# Altium project CS1237-24-Bit-ADC.PrjPcb
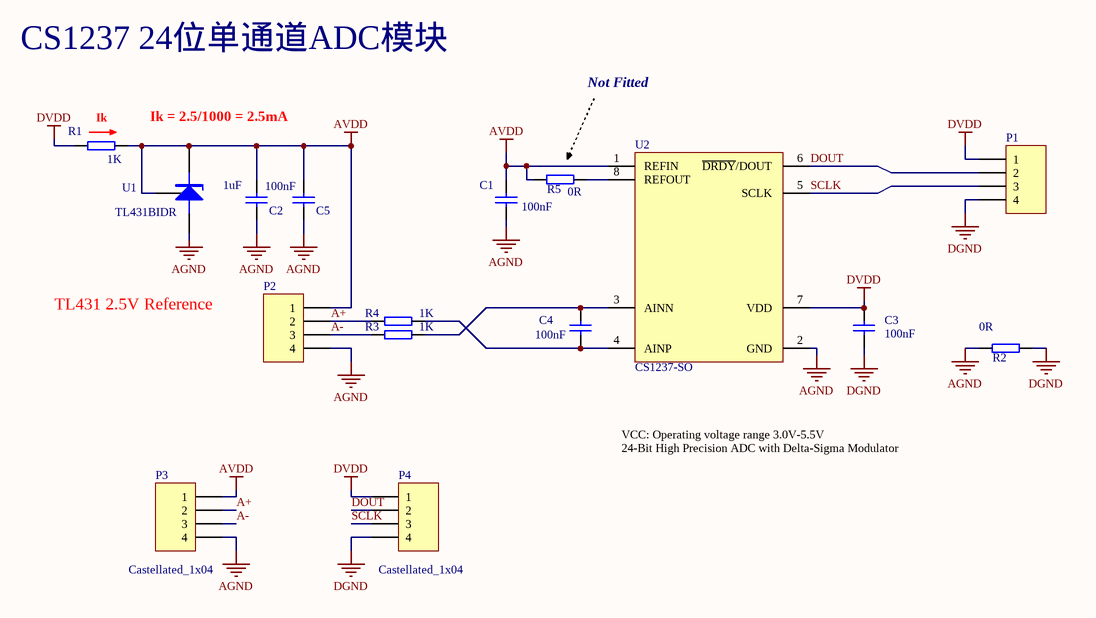
[diagram p0: CS1237-24-Bit-ADC.SchDoc]
1 sheet, 16 parts. Net scope: global (net labels, ports and power ports of the same name join across sheets).
Board file: CS1237-24-Bit-ADC.PcbDoc

## Sheet CS1237-24-Bit-ADC.SchDoc
size 279 x 199 mm

### Parts
C1  100nF  [C0603]  (value not drawn)
C2  1uF  [C0603]  (value not drawn)
C3  100nF  [C0603]  (value not drawn)
C4  100nF  [C0603]  (value not drawn)
C5  100nF  [C0603]  (value not drawn)
P1  (no value)  [HDR1X4]
P2  (no value)  [HDR1X4]
P3  Castellated_1x04  [Castellated_1X04]  (no BOM)
P4  Castellated_1x04  [Castellated_1X04]  (no BOM)
R1  1kΩ  [R0805]  (value not drawn)
R2  0Ω  [R0805]  (value not drawn)
R3  1kΩ  [R0603]  (value not drawn)
R4  1kΩ  [R0603]  (value not drawn)
R5  0Ω  [R0603]  (value not drawn)
U1  TL431BIDR  [SOIC-8E]
U2  CS1237-SO  [SOIC-8E]

### Nets
AGND: C1.2 C2.1 C5.2 P2.4 P3.4 R2.2 U1.3(A) U2.2(GND)
AVDD: C1.1 C2.2 C5.1 P2.1 P3.1 R1.2 R5.2 U1.1(K) U1.8(Ref) U2.1(REFIN)
DGND: C3.2 P1.4 P4.4 R2.1
DVDD: C3.1 P1.1 P4.1 R1.1 U2.7(VDD)
A+: P2.2 P3.2 R4.2
A-: P2.3 P3.3 R3.2
DOUT: P1.2 P4.2 U2.6(~{DRDY}/DOUT)
SCLK: P1.3 P4.3 U2.5(SCLK)
NetC4_1: C4.1 R3.1 U2.3(AINN)
NetC4_2: C4.2 R4.1 U2.4(AINP)
NetR5_1: R5.1 U2.8(REFOUT)

Not connected (* = marked no-connect by the designer): U1 4(NC) 5(NC)

### Notes on the sheet
- CS1237 24位单通道ADC模块
- (near R1) Ik
- Ik = 2.5/1000 = 2.5mA
- Not Fitted
- (near R1) 1K
- (near C2) 1uF
- 100nF
- (near R5) 0R
- TL431 2.5V Reference
- (near R4) 1K
- 1K
- (near C4) 100nF
- (near C3) 100nF
- (near R2) 0R
- VCC: Operating voltage range 3.0V-5.5V
- 24-Bit High Precision ADC with Delta-Sigma Modulator

### Library data of the parts
C1-C5 = Cap_0603: Capacitor, X5R, ±10%, 6.3V; Part Number: C0603-N.C.; Manufacturer: N.A.; Artikkelnr Noca: 20069060; Datasheet: *; LatestRevisionDate: 2009-11-23; Pin Count: 2; Publisher: Nordic Semiconductor; Published: 2009-05-08; Volts: 6.3V; Supplier: *; Supplier part number: *; 2nd source Supplier: *; 2nd source part number: *; Footprint Doc: 0603; Artikkelnr Simpro: N.A.; Manufacturer Part Number: N.A.
  C1 C3-C5: Value: 100nF
  C2: Value: 1uF
P1 P2 = Header 4: Header, 4-Pin; LatestRevisionDate: 17-Jul-2002; LatestRevisionNote: Re-released for DXP Platform.; Publisher: Altium Limited
P3 P4 = Castellated_1x04: Header, 4-Pin; LatestRevisionDate: 17-Jul-2002; LatestRevisionNote: Re-released for DXP Platform.; Publisher: Altium Limited
R1 R2 = Res_0805: Resistor, ±1%, 0.200W; Manufacturer: *; Specification: ±1%
  R1: Value: 1kΩ
  R2: Value: 0Ω
R3-R5 = Res_0603: Resistor, ±1%, 0.100W; Part Number: R0603-N.C.Ω; Manufacturer: N.A.; Note: Chip Res; Manufacturer Part Number: N.A.; Datasheet: *; Footprint Doc: 0603; LatestRevisionDate: 2009-05-08; Pin Count: 2; Publisher: Nordic Semiconductor; Published: 2009-05-08; Supplier: *; Supplier part number: *; 2nd source Supplier: *; 2nd source part number: *; Artikkelnr Noca: N.A.; Artikkelnr Simpro: N.A.
  R3 R4: Value: 1kΩ
  R5: Value: 0Ω
U1 = TL431BIDR: TL431, TL432 Precision Programmable Reference; pin to pad: 3>2+3+6+7; Manufacturer: TI(德州仪器); Add into BOM: yes; Output Type: Adjustable; Output Voltage: 2.495V~36V; Output Current: 100mA; Tolerance: ±0.5%; Reference Type: parallel connection; Minimum Cathode Current for Regulation: 700uA; Symbol: TL431BIDR; Device: TL431BIDR; LCSC Part Name: TL431BIDR; Supplier Part: C366884; Manufacturer Part: TL431BIDR; Supplier Footprint: SOIC-8; JLCPCB Part Class: Extended Part; Datasheet: https://www.ti.com/cn/lit/gpn/tl431; Supplier: LCSC; Convert to PCB: yes; Input Voltage: -; Temperature Coefficient: -; Supply Current: -; Noise - 1/10Hz to 10Hz: -; Noise - 10Hz to 10kHz: -; Operating Temperature: -40℃~+85℃@(Ta)
U2 = CS1237-SO_C7464028: CS1237 24-Bit High Precision ADC with Delta-Sigma Modulator; Manufacturer: CHIPSEA(芯海科技); Contributor: lcsc; Supplier: LCSC; Supplier Part: C7464028; Manufacturer Part: CS1237-SO; JLCPCB Part Class: Extended Part; spicePre: U; spiceSymbolName: CS1237-SO_C7464028